# Altium schematic sheet Complete Power Supply.SchDoc
size A3
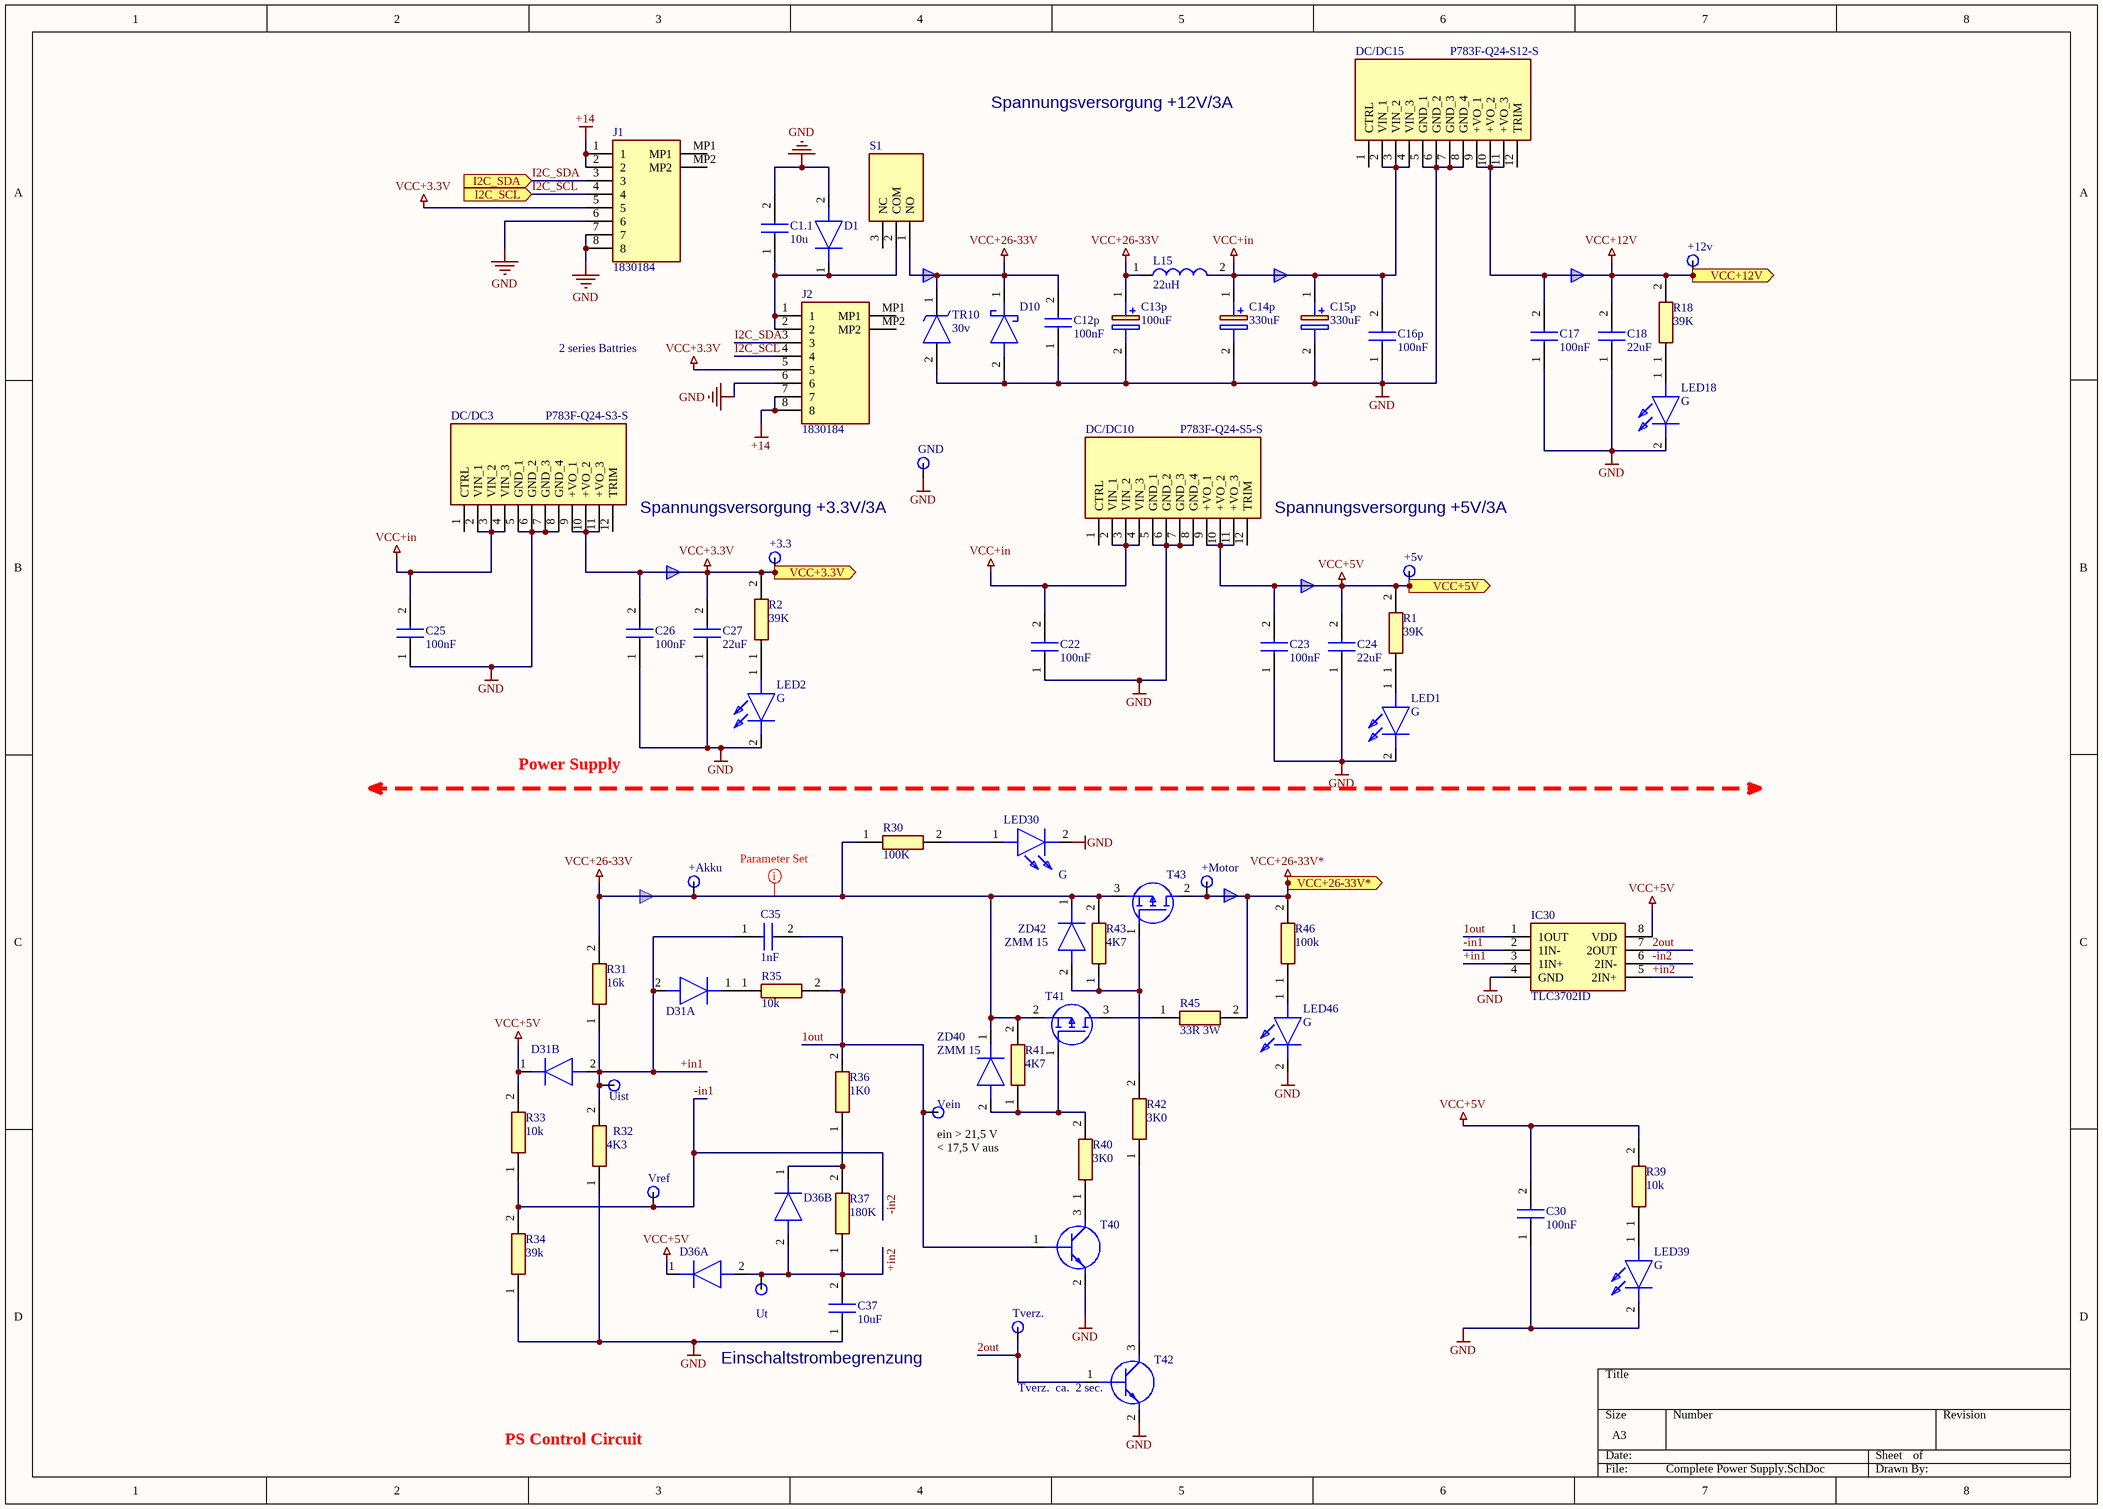
[diagram p0: Complete Power Supply.SchDoc]

## Parts
+3.3  TP  [TP]  (value not drawn)
+5v  TP  [TP]  (value not drawn)
+12v  TP  [TP]  (value not drawn)
+Akku  TP  [TP]  (value not drawn)
+Motor  TP  [TP]  (value not drawn)
C1.1  10u  [CAPC3216X180N]
C12p  100nF  [CAPC1608X90N]
C13p  100uF  [CAPPRD350W50D800H1750]
C14p  330uF  [CAPPRD500W60D1050H1750]
C15p  330uF  [CAPPRD500W60D1050H1750]
C16p  100nF  [CAPC1608X90N]
C17  100nF  [CAPC1608X90N]
C18  22uF  [CAPC3216X180N]
C22  100nF  [CAPC1608X90N]
C23  100nF  [CAPC1608X90N]
C24  22uF  [CAPC3216X180N]
C25  100nF  [CAPC1608X90N]
C26  100nF  [CAPC1608X90N]
C27  22uF  [CAPC3216X180N]
C30  100nF  [CAPC1608X90N]
C35  1nF  [CAPC1608X90N]
C37  10uF  [CAPC1608X90N]
D1  SM6T39A  [SMBJ36CATR]  (value not drawn)
D10  (no value)  [DIOM8059X295N]
D31A  BAS3010A03WE6327HTSA1  [SOD2513X110N]  (value not drawn)
D31B  BAS3010A03WE6327HTSA1  [SOD2513X110N]  (value not drawn)
D36A  BAS3010A03WE6327HTSA1  [SOD2513X110N]  (value not drawn)
D36B  BAS3010A03WE6327HTSA1  [SOD2513X110N]  (value not drawn)
DC/DC3  P783F-Q24-S3-S  [P783FQ24S12S]
DC/DC10  P783F-Q24-S5-S  [P783FQ24S12S]
DC/DC15  P783F-Q24-S12-S  [P783FQ24S12S]
GND  TP  [TP]  (value not drawn)
IC30  TLC3702ID  [SOIC127P600X175-8N]
J1  1830184  [1830184]
J2  1830184  [1830184]
L15  22uH  [INDPM7366X300N]
LED1  G  [KP2012SGD]
LED2  G  [KP2012SGD]
LED18  G  [KP2012SGD]
LED30  G  [KP2012SGD]
LED39  G  [KP2012SGD]
LED46  G  [KP2012SGD]
R1  39K  [RESC2012X65N]
R2  39K  [RESC2012X65N]
R18  39K  [RESC2012X65N]
R30  100K  [RESC2012X65N]
R31  16k  [RESC1608X60N]
R32  4K3  [RESC1608X60N]
R33  10k  [RESC1608X60N]
R34  39k  [RESC1608X60N]
R35  10k  [RESC1608X60N]
R36  1K0  [RESC1608X60N]
R37  180K  [RESC1608X60N]
R39  10k  [RESC2012X65N]
R40  3K0  [RESC1608X60N]
R41  4K7  [RESC1608X60N]
R42  3K0  [RESC1608X60N]
R43  4K7  [RESC1608X60N]
R45  33R 3W  [ERJ8_B_BW_R_LW_CW_D]
R46  100k  [RESC2012X65N]
S1  1-1825137-1  [118251371]  (value not drawn)
T40  BCR135WH6327XTSA1  [SOT65P210X100-3N]  (value not drawn)
T41  AO3407A  [SOT95P280X125-3N]  (value not drawn)
T42  BCR135WH6327XTSA1  [SOT65P210X100-3N]  (value not drawn)
T43  AUIRF9Z34N  [TO254P482X1016X2192-3P]  (value not drawn)
TR10  30v  [DIOM7959X262N]
Tverz.  TP  [TP]  (value not drawn)
Uist  TP  [TP]  (value not drawn)
Ut  TP  [TP]  (value not drawn)
Vein  TP  [TP]  (value not drawn)
Vref  TP  [TP]  (value not drawn)
ZD40  ZMM 15  [BZT55B13GS08]
ZD42  ZMM 15  [BZT55B13GS08]

## Ports
I2C_SCL (in), I2C_SDA (in), VCC+3.3V (out), VCC+5V (out), VCC+12V (out), VCC+26-33V* (out)

## Nets
+14: J1.1 J1.2 J2.7 J2.8
GND: C1.1.2 C12p.1 C13p.2(-) C14p.2(-) C15p.2(-) C16p.1 C17.1 C18.1 C22.1 C23.1 C24.1 C25.1 C26.1 C27.1 C30.1 C37.1 D1.2(A) D10.2(A) DC/DC3.5(GND_1) DC/DC3.6(GND_2) DC/DC3.7(GND_3) DC/DC3.8(GND_4) DC/DC10.5(GND_1) DC/DC10.6(GND_2) DC/DC10.7(GND_3) DC/DC10.8(GND_4) DC/DC15.5(GND_1) DC/DC15.6(GND_2) DC/DC15.7(GND_3) DC/DC15.8(GND_4) GND.25 IC30.4(GND) J1.6 J1.7 J1.8 J2.6 LED1.2(K) LED2.2(K) LED18.2(K) LED30.2(K) LED39.2(K) LED46.2(K) R32.1 R34.1 T40.2(E) T42.2(E) TR10.2(A)
VCC+3.3V: +3.3.25 C26.2 C27.2 DC/DC3.9(+VO_1) DC/DC3.10(+VO_2) DC/DC3.11(+VO_3) J1.5 J2.5 R2.2 ; port VCC+3.3V
VCC+5V: +5v.25 C23.2 C24.2 C30.2 D31B.1(K) D36A.1(K) DC/DC10.9(+VO_1) DC/DC10.10(+VO_2) DC/DC10.11(+VO_3) IC30.8(VDD) R1.2 R33.2 R39.2 ; port VCC+5V
VCC+12V: +12v.25 C17.2 C18.2 DC/DC15.9(+VO_1) DC/DC15.10(+VO_2) DC/DC15.11(+VO_3) R18.2 ; port VCC+12V
VCC+26-33V: +Akku.25 C12p.2 C13p.1(+) D10.1(K) L15.1 R30.1 R31.2 R41.2 R43.2 S1.1(NO) T41.2(S) T43.3(S) TR10.1(K) ZD40.1(K) ZD42.1(K)
VCC+26-33V*: +Motor.25 R45.2 R46.2 T43.2(D) ; port VCC+26-33V*
VCC+in: C14p.1(+) C15p.1(+) C16p.2 C22.2 C25.2 DC/DC3.2(VIN_1) DC/DC3.3(VIN_2) DC/DC3.4(VIN_3) DC/DC10.2(VIN_1) DC/DC10.3(VIN_2) DC/DC10.4(VIN_3) DC/DC15.2(VIN_1) DC/DC15.3(VIN_2) DC/DC15.4(VIN_3) L15.2
1out: C35.2 IC30.1(1OUT) R35.2 R36.2 T40.1(B) Vein.25
2out: IC30.7(2OUT) T42.1(B) Tverz..25
+in1: C35.1 D31A.2(A) D31B.2(A) IC30.3(1IN+) R31.1 R32.2 Uist.25
+in2: C37.2 D36A.2(A) D36B.2(A) IC30.5(2IN+) R37.1 Ut.25
-in1: IC30.2(1IN-) IC30.6(2IN-) R33.1 R34.2 Vref.25  [also labelled -in2]
I2C_SCL: J1.4 J2.4 ; port I2C_SCL
I2C_SDA: J1.3 J2.3 ; port I2C_SDA
NetC1.1_1: C1.1.1 D1.1(K) J2.1 J2.2 S1.2(COM)
NetD31A_1: D31A.1(K) R35.1
NetD36B_1: D36B.1(K) R36.1 R37.2
NetLED1_1: LED1.1(A) R1.1
NetLED2_1: LED2.1(A) R2.1
NetLED18_1: LED18.1(A) R18.1
NetLED30_1: LED30.1(A) R30.2
NetLED39_1: LED39.1(A) R39.1
NetLED46_1: LED46.1(A) R46.1
NetR40_1: R40.1 T40.3(C)
NetR40_2: R40.2 R41.1 T41.1(G) ZD40.2(A)
NetR42_1: R42.1 T42.3(C)
NetR42_2: R42.2 R43.1 T43.1(G) ZD42.2(A)
NetR45_1: R45.1 T41.3(D)

Not connected (* = marked no-connect by the designer): DC/DC3 1(CTRL) 12(TRIM); DC/DC10 1(CTRL) 12(TRIM); DC/DC15 1(CTRL) 12(TRIM); J1 MP1 MP2; J2 MP1 MP2; S1 3(NC)

## Layout directives
rule Clearance Constraint [Generic clearance = 0.2mm, and 9 value(s) for objects]: VCC+26-33V

## Notes on the sheet
- Spannungsversorgung +12V/3A
- 2 series Battries
- Spannungsversorgung +3.3V/3A
- (near DC/DC10) Spannungsversorgung +5V/3A
- Power Supply
- (near Vein) ein > 21,5 V
  < 17,5 V aus
- (near C37) Einschaltstrombegrenzung
- (near T42) Tverz.  ca.  2 sec.
- PS Control Circuit

## Library data of the parts
C1.1 = CL31A106KBHNNNE: Capacitor / CL31A106KBHNNNE; Manufacturer_Name: Samsung Electro-Mechanics; Datasheet Link: https://datasheet.datasheetarchive.com/originals/distributors/Datasheets_SAMA/08745f6325ae1679773301b11fb0567f.pdf; Height: 1.8mm; Manufacturer_Part_Number: CL31A106KBHNNNE; Mouser Part Number: 187-CL31A106KBHNNNE; Mouser Price/Stock: https://www.mouser.co.uk/ProductDetail/Samsung-Electro-Mechanics/CL31A106KBHNNNE?qs=X6jEic%2FHinBsSMnC%2FFnmbg%3D%3D; Arrow Part Number: CL31A106KBHNNNE; Arrow Price/Stock: https://www.arrow.com/en/products/cl31a106kbhnnne/samsung-electro-mechanics?region=nac
C12p C16p C17 C22 C23 C25 C26 C30 C35 C37 = GRM188R61E225KA12D: Capacitor / GRM188R61E225KA12D / 0603; Manufacturer_Name: Murata Electronics; Datasheet Link: https://psearch.en.murata.com/capacitor/product/GRM188R61E225KA12%23.html; Height: 0.9mm; Manufacturer_Part_Number: GRM188R61E225KA12D; Mouser Part Number: 81-GRM188R61E225KA2D; Mouser Price/Stock: https://www.mouser.co.uk/ProductDetail/Murata-Electronics/GRM188R61E225KA12D?qs=O5cugoO6nwcBgNVhHiS2FA%3D%3D; Arrow Part Number: GRM188R61E225KA12D; Arrow Price/Stock: https://www.arrow.com/en/products/grm188r61e225ka12d/murata-manufacturing?region=nac; LCSC Part #: C77047
C13p = 860080274012: Capacitor Polarised; Manufacturer_Name: Wurth Elektronik; Datasheet Link: https://www.we-online.de/katalog/datasheet/860080274012.pdf; Height: 17.5mm; Manufacturer_Part_Number: 860080274012
C14p C15p = 25YXF470M10X16: Capacitor Polarised; Manufacturer_Name: Rubycon; Datasheet Link: https://datasheet.octopart.com/25YXF470M10X16-Rubycon-datasheet-5377913.pdf; Height: 17.5mm; Manufacturer_Part_Number: 25YXF470M10X16
C18 C24 C27 = GRM31CR61H106MA12L: Capacitor / GRM31CR61H106MA12L / 1206; Manufacturer_Name: Murata Electronics; Datasheet Link: https://datasheet.datasheetarchive.com/originals/distributors/DKDS-10/192395.pdf; Height: 1.8mm; Manufacturer_Part_Number: GRM31CR61H106MA12L; Mouser Part Number: 81-GRM31CR61H106MA2L; Mouser Price/Stock: https://www.mouser.co.uk/ProductDetail/Murata-Electronics/GRM31CR61H106MA12L/?qs=eeBpzGFlv%252B9KISFXBDHybg%3D%3D; Arrow Part Number: GRM31CR61H106MA12L; Arrow Price/Stock: https://www.arrow.com/en/products/grm31cr61h106ma12l/murata-manufacturing?region=europe; LCSC Part #: C882507
D1 = SM6T39A: Diode; Manufacturer_Name: STMicroelectronics; Datasheet Link: https://datasheet.datasheetarchive.com/originals/distributors/Datasheets-20/DSA-387610.pdf; Height: 2.65mm; Manufacturer_Part_Number: SM6T39A; Mouser Part Number: 511-SM6T39A; Mouser Price/Stock: https://www.mouser.co.uk/ProductDetail/STMicroelectronics/SM6T39A?qs=1tTY8DFIKACDikxFTWVTXw%3D%3D; Arrow Part Number: SM6T39A; Arrow Price/Stock: https://www.arrow.com/en/products/sm6t39a/stmicroelectronics
D10 = 30BQ015TR: Schottky Diode / 30BQ015TR; Manufacturer_Name: SMC Diode Solutions; Datasheet Link: http://www.smc-diodes.com/propdf/30BQ015%20N0025%20REV.A.pdf; Height: 2.95mm; Manufacturer_Part_Number: 30BQ015TR
D31A D31B D36A D36B = BAS3010A03WE6327HTSA1: Diode; Manufacturer_Name: Infineon; Datasheet Link: https://www.infineon.com/dgdl/Infineon-BAS3010ASERIES-DS-v01_01-en.pdf?fileId=db3a30431ddc9372011dfbc50f231c06; Height: 1.1mm; Manufacturer_Part_Number: BAS3010A03WE6327HTSA1; Mouser Part Number: 726-BAS3010A-03WE6; Mouser Price/Stock: https://www.mouser.co.uk/ProductDetail/Infineon-Technologies/BAS3010A03WE6327HTSA1?qs=K00xGehIljtEbk1%252B2pLZ%252BQ%3D%3D; Arrow Part Number: BAS3010A03WE6327HTSA1; Arrow Price/Stock: https://www.arrow.com/en/products/bas3010a03we6327htsa1/infineon-technologies-ag?region=nac
DC/DC3 DC/DC10 DC/DC15 = P783F-Q24-S12-S: Power Supply / P783F-Q24-S12-S; Manufacturer_Name: CUI Inc.; Datasheet Link: https://www.cui.com/product/resource/p783f-s.pdf; Height: 13mm; Manufacturer_Part_Number: P783F-Q24-S12-S; Mouser Part Number: 490-P783F-Q24-S12-S; Mouser Price/Stock: https://www.mouser.co.uk/ProductDetail/CUI-Inc/P783F-Q24-S12-S?qs=sPbYRqrBIVljRPgIyO3l8A%3D%3D
IC30 = TLC3702ID: Integrated Circuit; Manufacturer_Name: Texas Instruments; Datasheet Link: http://www.ti.com/lit/ds/symlink/tlc3702.pdf; Height: 1.75mm; Manufacturer_Part_Number: TLC3702ID; Mouser Part Number: 595-TLC3702ID; Mouser Price/Stock: https://www.mouser.co.uk/ProductDetail/Texas-Instruments/TLC3702ID?qs=N6WZOzgtpqUb%252BRDgy00dsg%3D%3D; Arrow Part Number: TLC3702ID; Arrow Price/Stock: https://www.arrow.com/en/products/tlc3702id/texas-instruments
J1 J2 = 1830184: Connector; Manufacturer_Name: Phoenix Contact; Datasheet Link: https://www.phoenixcontact.com/online/portal/us/?uri=pxc-oc-itemdetail:pid=1830184&library=usen&pcck=P-11-02-11&tab=1&selectedCategory=ALL; Height: 8.35mm; Manufacturer_Part_Number: 1830184; Mouser Part Number: 651-1830184; Mouser Price/Stock: https://www.mouser.co.uk/ProductDetail/Phoenix-Contact/1830184?qs=o1waKiAPAqfS6fAOQz7r2w%3D%3D; Arrow Part Number: 1830184; Arrow Price/Stock: https://www.arrow.com/en/products/1830184/phoenix-contact?region=nac
L15 = 74437346068: Inductor; Manufacturer_Name: Wurth Elektronik; Datasheet Link: https://katalog.we-online.com/pbs/datasheet/74437346068.pdf; Height: 3mm; Manufacturer_Part_Number: 74437346068; Mouser Part Number: 710-74437346068; Mouser Price/Stock: https://www.mouser.co.uk/ProductDetail/Wurth-Elektronik/74437346068?qs=cFlH0mFHHFr7wDblh%2FbjSQ%3D%3D
LED1 LED2 LED18 LED30 LED39 LED46 = KP-2012SGD: LED / KP-2012SGD / 0805; Manufacturer_Name: Kingbright; Datasheet Link: https://www.arrow.com/en/products/kp-2012sgd/kingbright; Height: 1.2mm; Manufacturer_Part_Number: KP-2012SGD; Mouser Part Number: N/A; Mouser Price/Stock: https://www.mouser.co.uk/ProductDetail/Kingbright/KP-2012SGD?qs=2JU0tDl2GZ3ofCdUidPmmg%3D%3D; Arrow Part Number: KP-2012SGD; Arrow Price/Stock: https://www.arrow.com/en/products/kp-2012sgd/kingbright
R1 R2 R18 R30 R39 R46 = CPF0805B100RE1: Resistor / CPF0805B100RE1 / 0805; Manufacturer_Name: TE Connectivity; Datasheet Link: https://datasheet.datasheetarchive.com/originals/distributors/DKDS-21/401696.pdf; Height: 0.65mm; Manufacturer_Part_Number: CPF0805B100RE1; Mouser Part Number: 279-CPF0805B100RE1; Mouser Price/Stock: https://www.mouser.co.uk/ProductDetail/TE-Connectivity-Holsworthy/CPF0805B100RE1?qs=9ylKvqdyudkCWLPT1QvLZQ%3D%3D; Arrow Part Number: CPF0805B100RE1; Arrow Price/Stock: https://www.arrow.com/en/products/cpf0805b100re1/te-connectivity?region=nac
R31-R37 R40-R43 = MCSR06X47R0FTL: Resistor / 0603; Manufacturer_Name: MULTICOMP; Datasheet Link: http://www.farnell.com/datasheets/1716710.pdf?_ga=1.256651403.1411154270.1472651675; Height: 0.6mm; Manufacturer_Part_Number: MCSR06X47R0FTL
R45 = ERJ-8BWFR075V: Resistor / 1206 / 33R 3W; Manufacturer_Name: Panasonic; Datasheet Link: http://industrial.panasonic.com/cdbs/www-data/pdf/RDN0000/AOA0000C313.pdf; Manufacturer_Part_Number: ERJ-8BWFR075V; Mouser Part Number: 667-ERJ-8BWFR075V; Mouser Price/Stock: https://www.mouser.co.uk/ProductDetail/Panasonic/ERJ-8BWFR075V?qs=KH2o3k57USiX44P74%2FQfRA%3D%3D; Arrow Part Number: ERJ-8BWFR075V; Arrow Price/Stock: https://www.arrow.com/en/products/erj-8bwfr075v/panasonic; LCSC Part #: *
S1 = 1-1825137-1: Switch single pole single throw; Manufacturer_Name: TE Connectivity; Datasheet Link: https://www.mouser.com/datasheet/2/418/NG_CD_1825137_A7_baseFilename-660113.pdf; Height: 28.194mm; Manufacturer_Part_Number: 1-1825137-1; Mouser Part Number: N/A; Mouser Price/Stock: https://www.mouser.com/Search/Refine.aspx?Keyword=N%2FA
T40 T42 = BCR135WH6327XTSA1: Digitaltransistor, npn, 50V, 100mA, SOT23; Manufacturer_Name: Infineon; Datasheet Link: https://componentsearchengine.com/Datasheets/1/BCR135WH6327XTSA1.pdf; Height: 1mm; Manufacturer_Part_Number: BCR135WH6327XTSA1; Mouser Part Number: 726-BCR135WH6327XTSA; Mouser Price/Stock: https://www.mouser.com/Search/Refine.aspx?Keyword=726-BCR135WH6327XTSA; Arrow Part Number: BCR135WH6327XTSA1; Arrow Price/Stock: https://www.arrow.com/en/products/bcr135wh6327xtsa1/infineon-technologies-ag
T41 = AO3407A: MOS-FET, p-Kanal, -40  V, -3,4 A, SOT23; Manufacturer_Name: Alpha & Omega Semiconductors; Datasheet Link: http://www.aosmd.com/pdfs/datasheet/ao3407a.pdf; Height: 1.25mm; Manufacturer_Part_Number: AO3407A; Arrow Part Number: AO3407A; Arrow Price/Stock: https://www.arrow.com/en/products/ao3407a/alpha-and-omega-semiconductor?region=nac
T43 = AUIRF9Z34N: MOS-FET, p-Kanal, -40  V, -120 A, TO220; Manufacturer_Name: Infineon; Datasheet Link: https://www.infineon.com/dgdl/auirf9z34n.pdf?fileId=5546d462533600a4015355b0fd23141c; Height: 4.82mm; Manufacturer_Part_Number: AUIRF9Z34N; Mouser Part Number: 942-AUIRF9Z34N; Mouser Price/Stock: https://www.mouser.com/Search/Refine.aspx?Keyword=942-AUIRF9Z34N; Arrow Part Number: AUIRF9Z34N; Arrow Price/Stock: https://www.arrow.com/en/products/auirf9z34n/infineon-technologies-ag
TR10 = 1.5SMC15A: Überspannungsdiode, 30 V, 3000 W, DO214-AB, unidirektional, SMD; Manufacturer_Name: LITTELFUSE; Datasheet Link: https://componentsearchengine.com/Datasheets/2/1.5SMC15A.pdf; Height: 2.62mm; Manufacturer_Part_Number: 1.5SMC15A; Mouser Part Number: 576-1.5SMC15A; Mouser Price/Stock: https://www.mouser.co.uk/ProductDetail/Littelfuse/15SMC15A?qs=JJML70Qc14sYvtvez3q0iw%3D%3D
ZD40 ZD42 = LS4150GS08: SOD-80 / ZMM 15, 5%; Manufacturer_Name: Vishay; Datasheet Link: https://www.vishay.com/docs/85562/ls4150.pdf; Height: 1mm; Manufacturer_Part_Number: LS4150GS08; Mouser Part Number: 78-LS4150; Mouser Price/Stock: https://www.mouser.co.uk/ProductDetail/Vishay-Semiconductors/LS4150GS08?qs=RzxYCzJDjPXu3Zrfu5SCoA%3D%3D